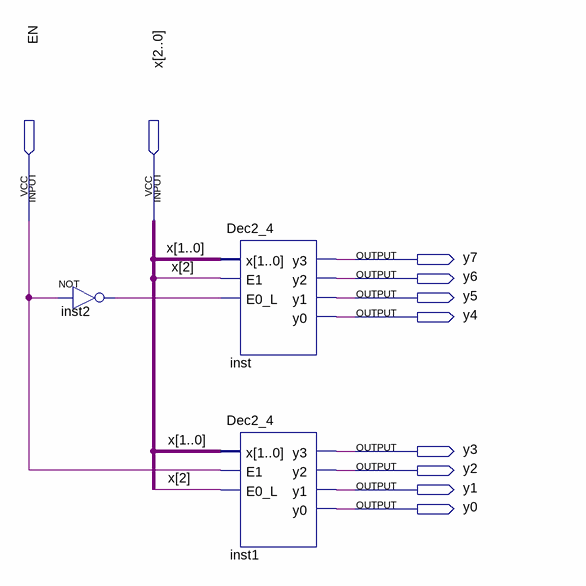
[diagram p0: schematic sheet]
// Quartus schematic Dec3_8_w24.bdf as structural Verilog: 3 symbols, 10 pins
module Dec3_8_w24 (
  input  EN,
  input  [2:0] x,
  output y7,
  output y6,
  output y5,
  output y4,
  output y3,
  output y2,
  output y1,
  output y0
);

  wire inst2_out;

  not inst2 (inst2_out, EN);
  Dec2_4 inst (.x(x[1:0]), .E1(x[2]), .E0_L(inst2_out), .y3(y7), .y2(y6), .y1(y5), .y0(y4));
  Dec2_4 inst1 (.x(x[1:0]), .E1(EN), .E0_L(x[2]), .y3(y3), .y2(y2), .y1(y1), .y0(y0));
endmodule
